# EasyEDA schematic schéma_pro_easyeda.json
TITLE: Sheet_1; REV: 1.0; Date: 2022-01-26; Sheet: 1/1; Company: Your Company
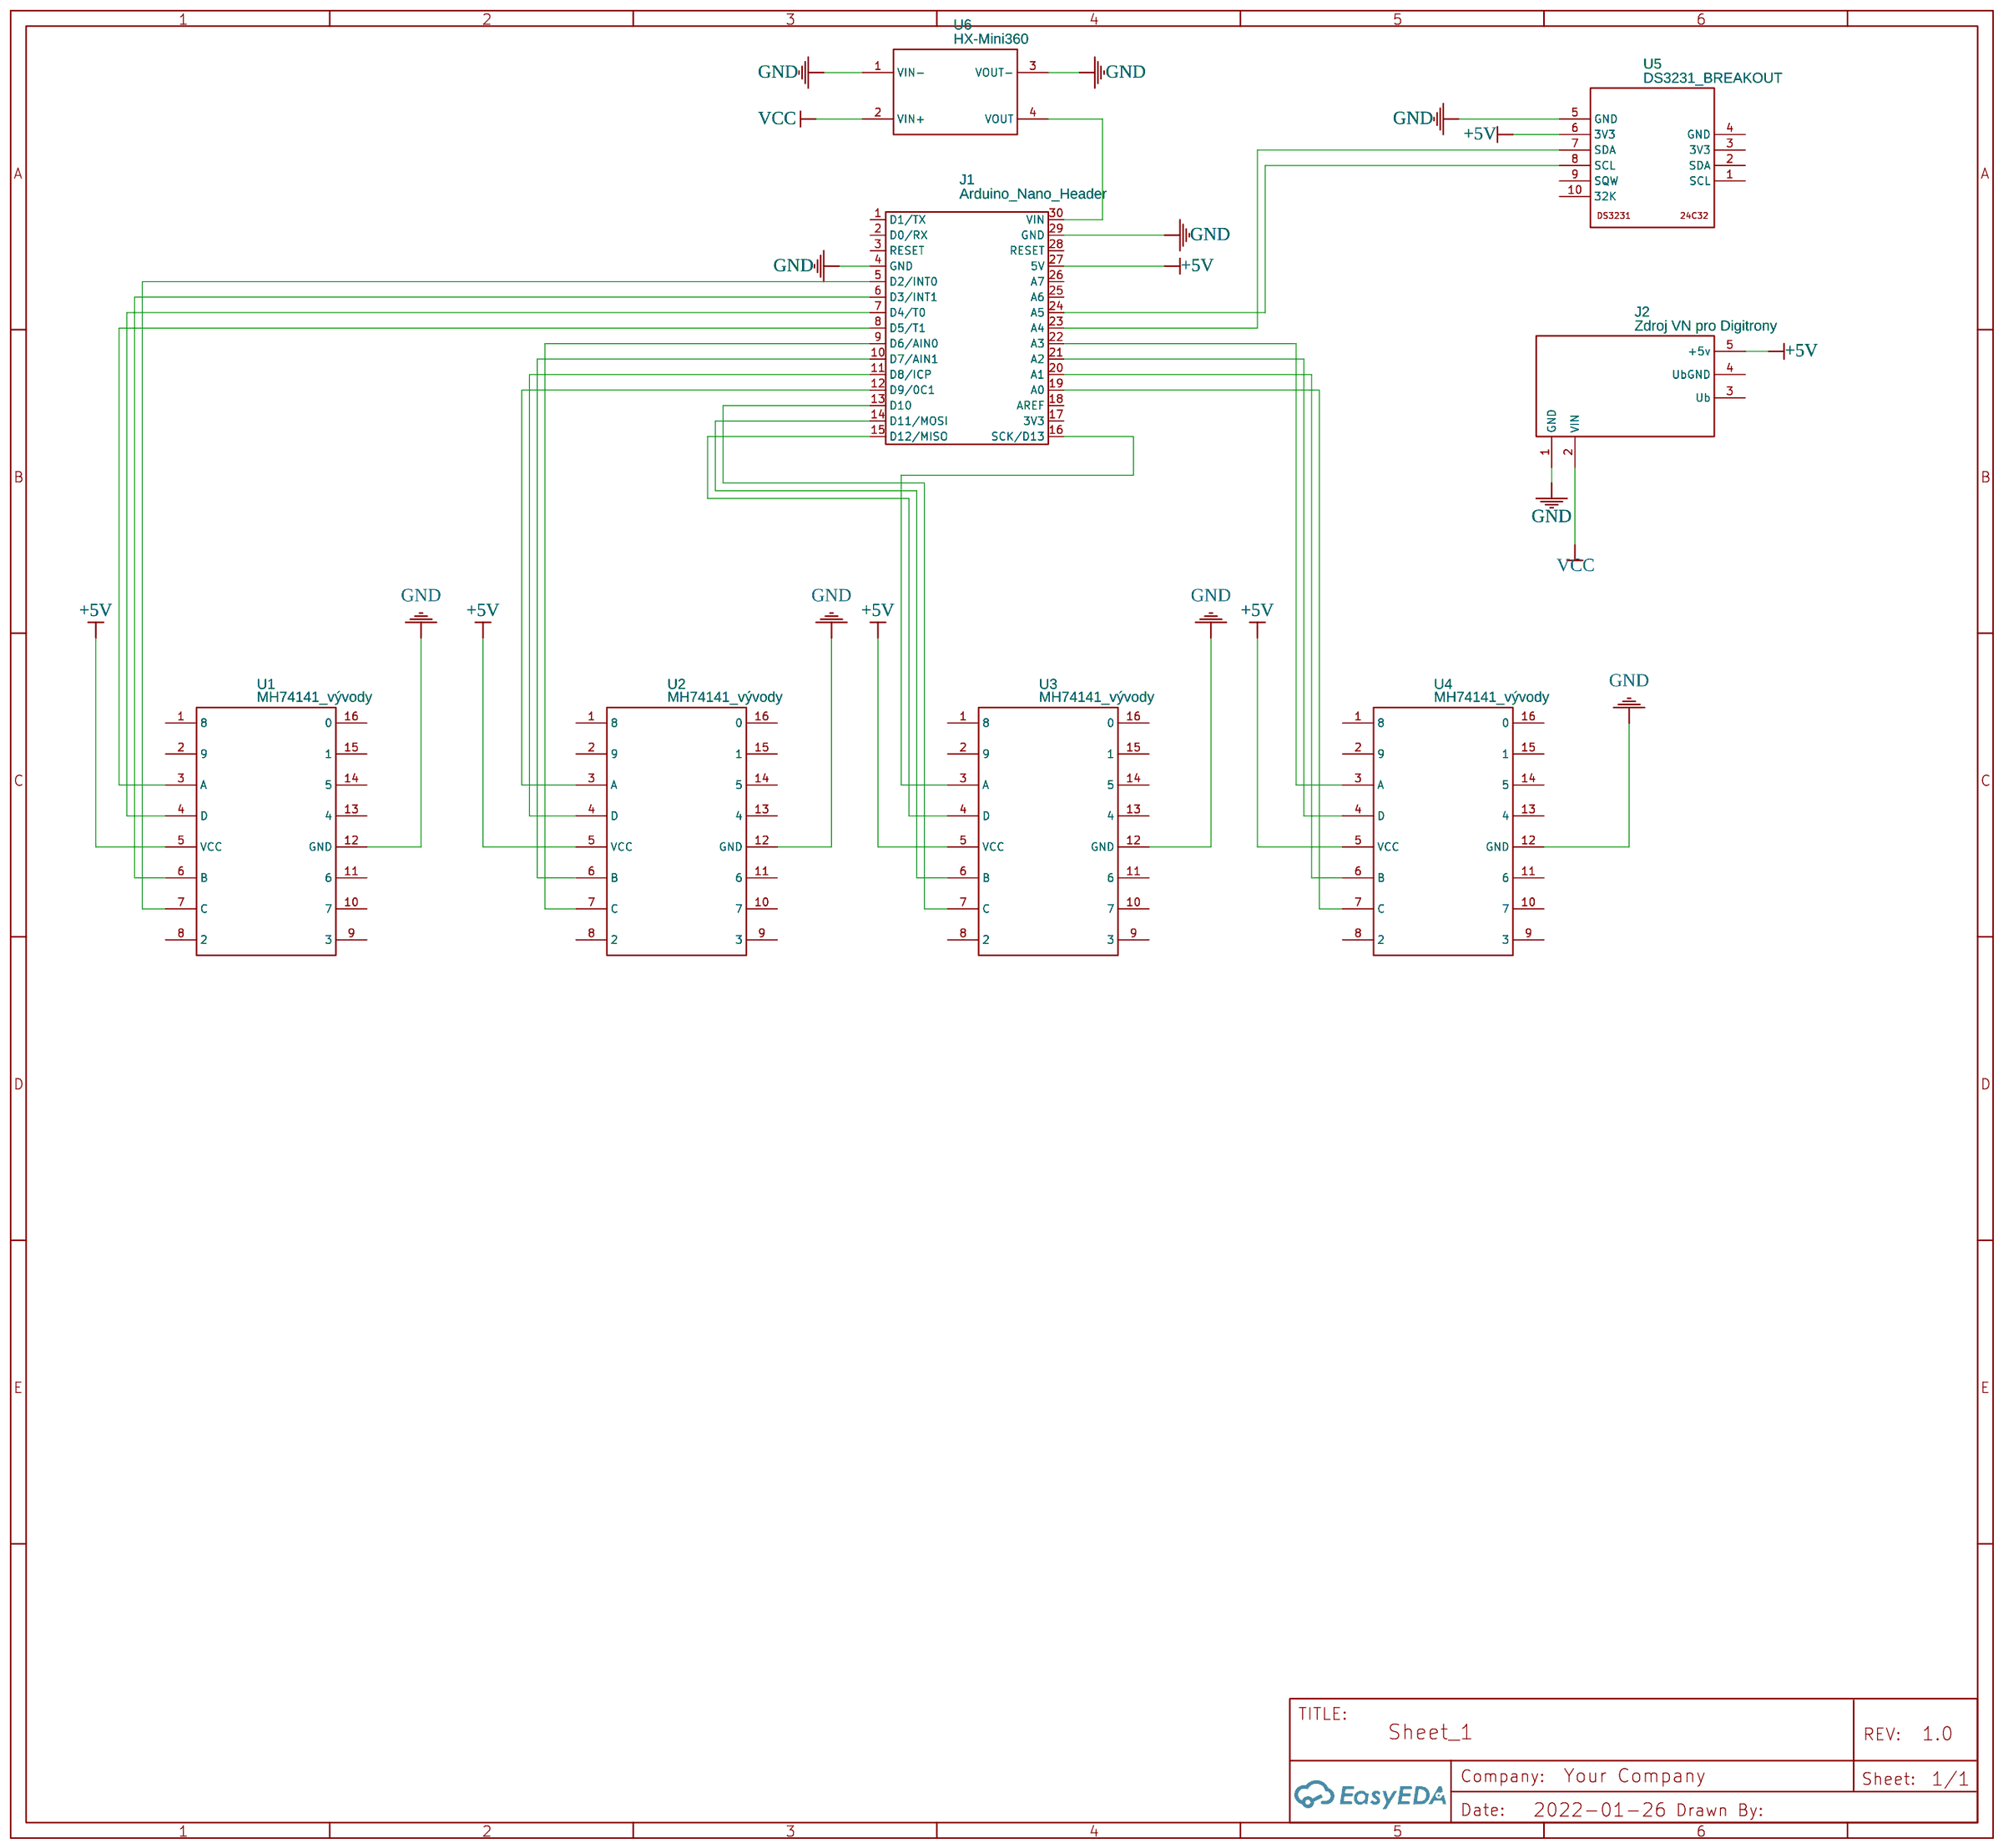
[diagram p0: schematic sheet]

## Parts
J1  Arduino_Nano_Header  [DIP-30_L43.18-W15.24-ARDUINONANO]
J2  Zdroj VN pro Digitrony  [ZDROJ_UB_FOOTPRINT]
U1  MH74141_vývody  [DIP16_S_VÝVODY]
U2  MH74141_vývody  [DIP16_S_VÝVODY]
U3  MH74141_vývody  [DIP16_S_VÝVODY]
U4  MH74141_vývody  [DIP16_S_VÝVODY]
U5  DS3231_BREAKOUT  [DS3231_BREAKOUT]
U6  HX-Mini360  [HX-MINI360-FOOTPRINT]

## Library data of the parts
J1 = Arduino_Nano_Header
J2 = Zdroj VN pro Digitrony: link: https://www.ebay.com/itm/172691279103?_trkparms=amclksrc%3DITM%26aid%3D111001%26algo%3DREC.SEED%26ao%3D1%26asc%3D20180816085401%26meid%3Ddda00a658e0642a8a6f145239242aaa0%26pid%3D100970%26rk%3D2%26rkt%3D3%26sd%3D131964707917%26itm%3D172691279103%26pmt%3D0%26noa%3D1%26pg%3D2380057%26brand%3DUnbranded&_trksid=p2380057.c100970.m5481&_trkparms=pageci%3A55e23570-97ac-11ec-9c3e-aa1d0b5199b5%7Cparentrq%3A3a6d037417f0ab8f0ebd8fcdfffc4aa6%7Ciid%3A1; Contributor: xonarvisuals
U1-U4 = MH74141_vývody: Contributor: Sjoertdb
U5 = DS3231_BREAKOUT: Supplier Part: undefined; link: https://www.amazon.fr/AZDelivery-RTC-gratuite-Raspberry-microcontr%C3%B4leur/dp/B01M2B7HQB/ref=sr_1_2?ie=UTF8&qid=1539115964&sr=8-2&keywords=ds3231; Contributor: rom1nux
U6 = HX-Mini360: Contributor: xonarvisuals

## Nets
+5V: J1.27(5V) J2.5(+5v) U1.5(VCC) U2.5(VCC) U3.5(VCC) U4.5(VCC) U5.6(3V3)
GND: J1.4(GND) J1.29(GND) J2.1(GND) U1.12(GND) U2.12(GND) U3.12(GND) U4.12(GND) U5.5(GND) U6.1(VIN-) U6.3(VOUT-)
VCC: J2.2(VIN) U6.2(VIN+)
Net-(J1-5): J1.5(D2/INT0) U1.7(C)
Net-(J1-6): J1.6(D3/INT1) U1.6(B)
Net-(J1-7): J1.7(D4/T0) U1.4(D)
Net-(J1-8): J1.8(D5/T1) U1.3(A)
Net-(J1-9): J1.9(D6/AIN0) U2.7(C)
Net-(J1-10): J1.10(D7/AIN1) U2.6(B)
Net-(J1-11): J1.11(D8/ICP) U2.4(D)
Net-(J1-12): J1.12(D9/0C1) U2.3(A)
Net-(J1-13): J1.13(D10) U3.7(C)
Net-(J1-14): J1.14(D11/MOSI) U3.6(B)
Net-(J1-15): J1.15(D12/MISO) U3.4(D)
Net-(J1-16): J1.16(SCK/D13) U3.3(A)
Net-(J1-19): J1.19(A0) U4.7(C)
Net-(J1-20): J1.20(A1) U4.6(B)
Net-(J1-21): J1.21(A2) U4.4(D)
Net-(J1-22): J1.22(A3) U4.3(A)
Net-(J1-23): J1.23(A4) U5.7(SDA)
Net-(J1-24): J1.24(A5) U5.8(SCL)
Net-(J1-30): J1.30(VIN) U6.4(VOUT)

Not connected (* = marked no-connect by the designer): J1 1(D1/TX) 2(D0/RX) 3(RESET) 17(3V3) 18(AREF) 25(A6) 26(A7) 28(RESET); J2 3(Ub) 4(UbGND); U1 1(8) 2(9) 8(2) 9(3) 10(7) 11(6) 13(4) 14(5) 15(1) 16(0); U2 1(8) 2(9) 8(2) 9(3) 10(7) 11(6) 13(4) 14(5) 15(1) 16(0); U3 1(8) 2(9) 8(2) 9(3) 10(7) 11(6) 13(4) 14(5) 15(1) 16(0); U4 1(8) 2(9) 8(2) 9(3) 10(7) 11(6) 13(4) 14(5) 15(1) 16(0); U5 1(SCL) 2(SDA) 3(3V3) 4(GND) 9(SQW) 10(32K)
